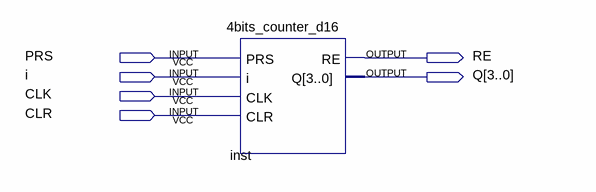
[diagram p0: schematic sheet]
// Quartus schematic test3.bdf as structural Verilog: 1 symbols, 6 pins
module test3 (
  input  PRS,
  input  i,
  input  CLK,
  input  CLR,
  output RE,
  output [3:0] Q
);

  \4bits_counter_d16  inst (.PRS(PRS), .i(i), .CLK(CLK), .CLR(CLR), .RE(RE), .Q(Q));
endmodule
